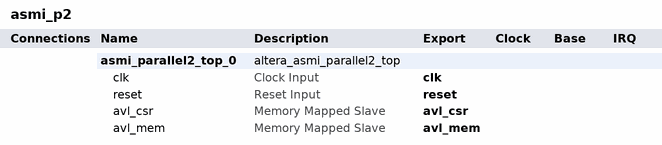
[diagram p0: system contents]
# Platform Designer (Qsys) system asmi_p2, Cyclone 10 LP 10CL025YU256C8G
# Parameters at their usual value, and those the tool derives, are not listed.
package require -exact qsys 20.1
create_system asmi_p2
set_project_property DEVICE_FAMILY {Cyclone 10 LP}
set_project_property DEVICE 10CL025YU256C8G

add_instance asmi_parallel2_top_0 altera_asmi_parallel2_top 20.1
set_instance_property asmi_parallel2_top_0 AUTO_EXPORT true
set_instance_parameter_value asmi_parallel2_top_0 CHIP_SELECT_EN true
set_instance_parameter_value asmi_parallel2_top_0 DATA_WIDTH STANDARD
set_instance_parameter_value asmi_parallel2_top_0 ENABLE_SIM_MODEL false
set_instance_parameter_value asmi_parallel2_top_0 FLASH_TYPE EPCQ16A
set_instance_parameter_value asmi_parallel2_top_0 NCS_NUM 1
set_instance_parameter_value asmi_parallel2_top_0 PIPE_CMD_GEN_CMD 0
set_instance_parameter_value asmi_parallel2_top_0 PIPE_CSR 0
set_instance_parameter_value asmi_parallel2_top_0 PIPE_MUX_CMD 0
set_instance_parameter_value asmi_parallel2_top_0 PIPE_XIP 0
set_instance_parameter_value asmi_parallel2_top_0 USE_ASMIBLOCK false
set_instance_parameter_value asmi_parallel2_top_0 USE_GPIO false

# exported interfaces
add_interface avl_csr avalon slave
set_interface_property avl_csr EXPORT_OF asmi_parallel2_top_0.avl_csr
add_interface avl_mem avalon slave
set_interface_property avl_mem EXPORT_OF asmi_parallel2_top_0.avl_mem
add_interface clk clock sink
set_interface_property clk EXPORT_OF asmi_parallel2_top_0.clk
add_interface reset reset sink
set_interface_property reset EXPORT_OF asmi_parallel2_top_0.reset

set_interconnect_requirement {$system} qsys_mm.clockCrossingAdapter HANDSHAKE
set_interconnect_requirement {$system} qsys_mm.enableEccProtection FALSE
set_interconnect_requirement {$system} qsys_mm.insertDefaultSlave FALSE
set_interconnect_requirement {$system} qsys_mm.maxAdditionalLatency 1

save_system asmi_p2.qsys
